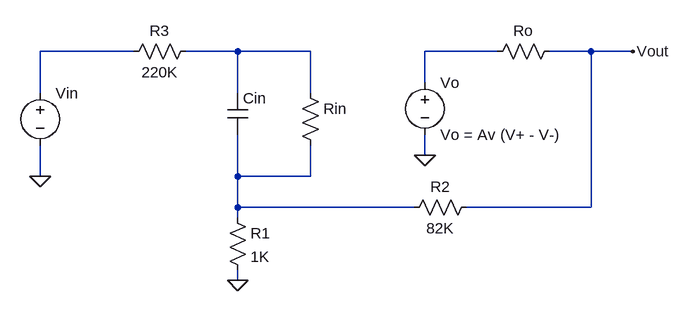
[diagram p0: schematic Circuito a analizar.asc]
Circuito a analizar.asc, the LTspice schematic file:
Version 4
SHEET 1 1156 680
WIRE -272 288 -416 288
WIRE -112 288 -192 288
WIRE 0 288 -112 288
WIRE 288 288 176 288
WIRE 432 288 368 288
WIRE 496 288 432 288
WIRE 176 336 176 288
WIRE -416 352 -416 288
WIRE -112 352 -112 288
WIRE 0 352 0 288
WIRE 176 448 176 416
WIRE -416 480 -416 432
WIRE -112 480 -112 416
WIRE 0 480 0 432
WIRE 0 480 -112 480
WIRE -112 528 -112 480
WIRE 160 528 -112 528
WIRE 432 528 432 288
WIRE 432 528 240 528
WIRE -112 544 -112 528
WIRE -112 640 -112 624
FLAG -112 640 0
FLAG 496 288 Vout
FLAG 176 448 0
FLAG -416 480 0
SYMBOL res -128 528 R0
SYMATTR InstName R1
SYMATTR Value 1K
SYMBOL res 256 512 R90
WINDOW 0 0 56 VBottom 2
WINDOW 3 32 56 VTop 2
SYMATTR InstName R2
SYMATTR Value 82K
SYMBOL res -176 272 R90
WINDOW 0 0 56 VBottom 2
WINDOW 3 32 56 VTop 2
SYMATTR InstName R3
SYMATTR Value 220K
SYMBOL res -16 336 R0
SYMATTR InstName Rin
SYMATTR Value ""
SYMBOL cap -128 352 R0
SYMATTR InstName Cin
SYMATTR Value ""
SYMBOL voltage 176 320 R0
SYMATTR InstName Vo
SYMATTR Value Vo = Av (V+ - V-)
SYMBOL res 384 272 R90
WINDOW 0 0 56 VBottom 2
WINDOW 3 32 56 VTop 2
SYMATTR InstName Ro
SYMATTR Value ""
SYMBOL voltage -416 336 R0
SYMATTR InstName Vin
SYMATTR Value ""

The netlist it stands for:
* Circuito a analizar.asc
R1 N004 0 1K
R2 Vout N004 82K
R3 N002 N001 220K
Rin N002 N004
Cin N002 N004
Vo N003 0 Vo = Av (V+ - V-)
Ro Vout N003
Vin N001 0
.backanno
.end